# EAGLE design Adafruit MAX98306 (EAGLE 6.4)
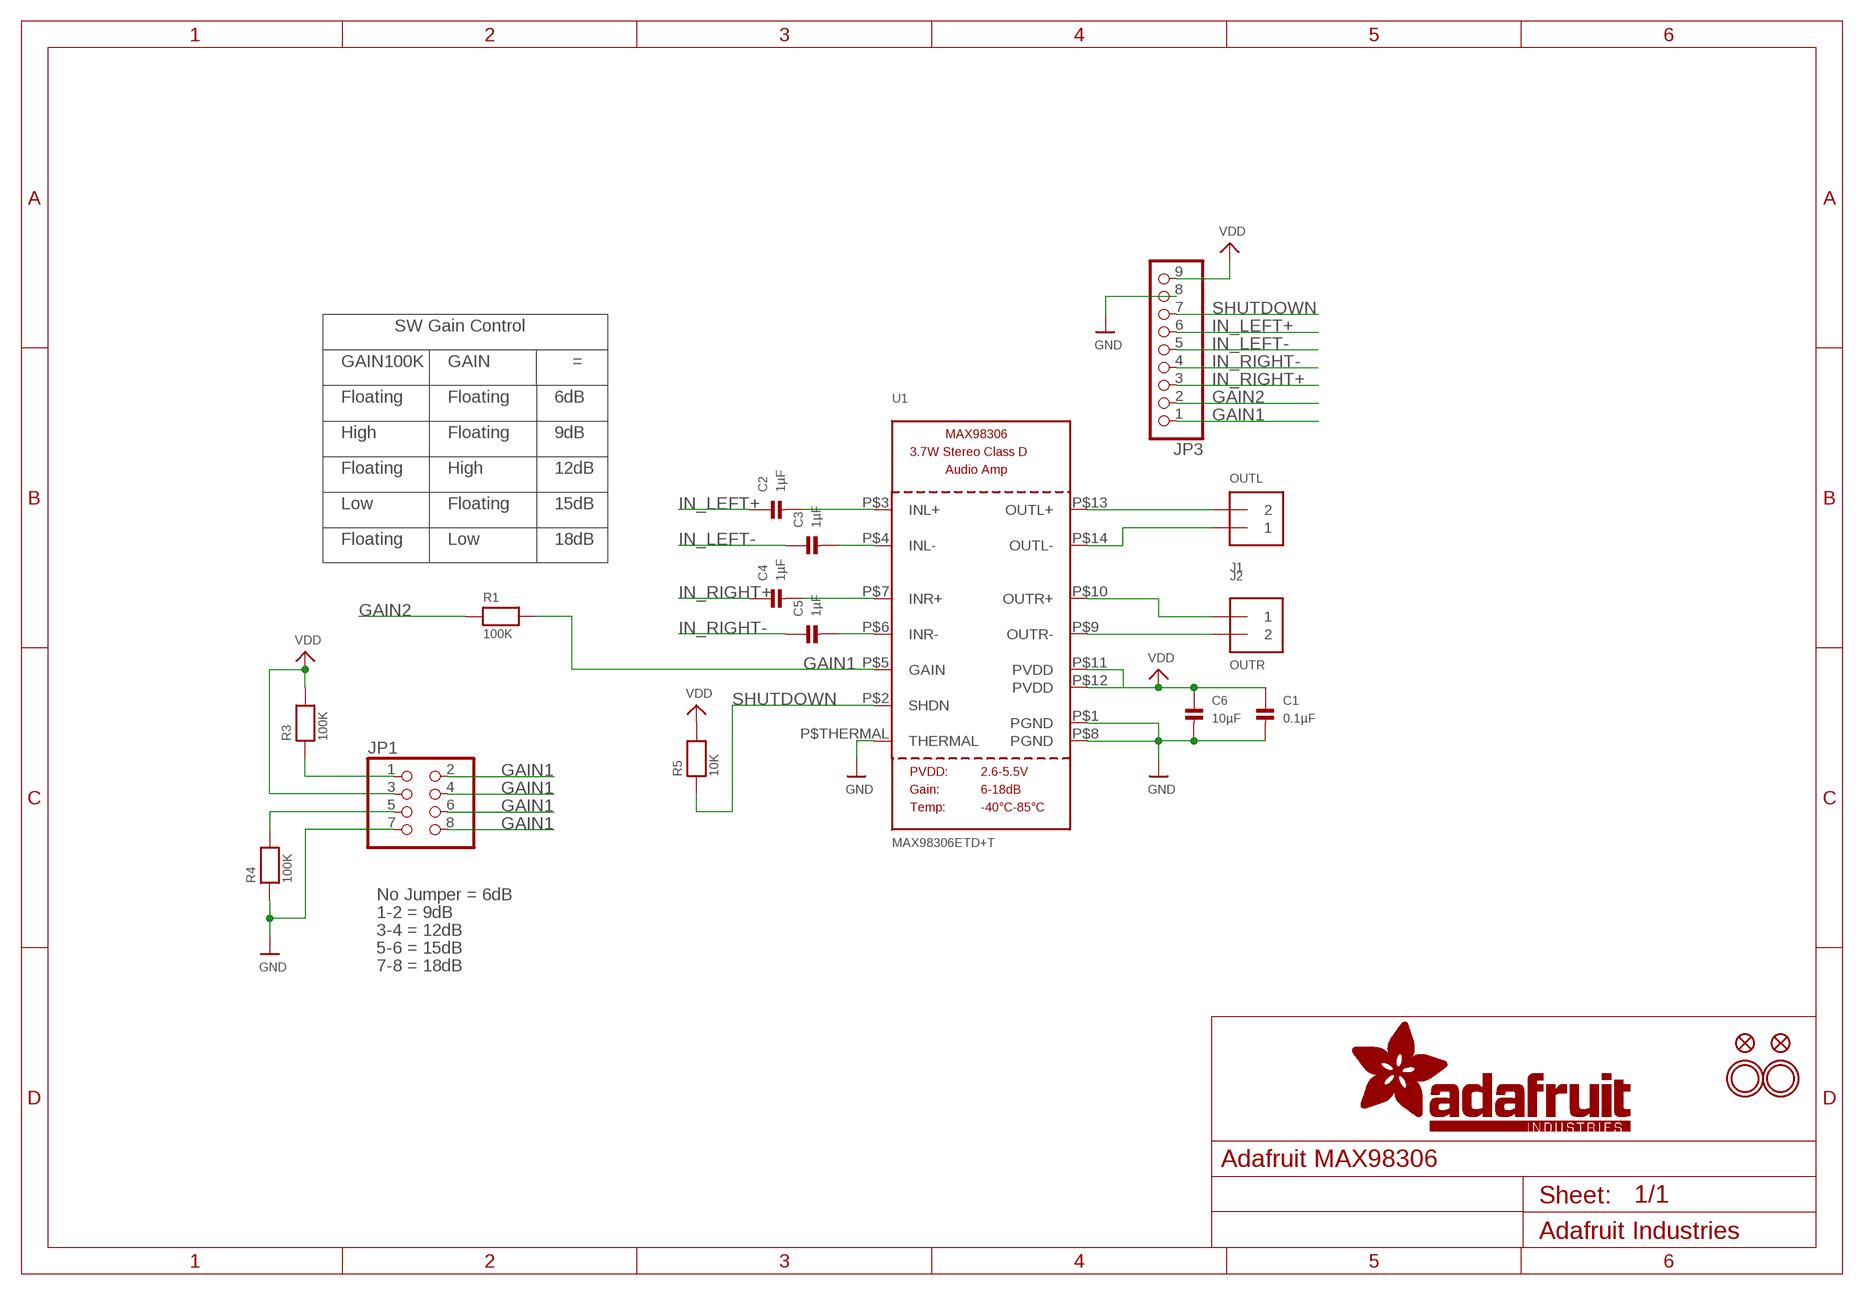
[diagram p0: schematic, sheet 1]

## Parts
C1  0.1µF  CAP_CERAMIC0805  [0805]
C2  1µF  CAP_CERAMIC0805  [0805]
C3  1µF  CAP_CERAMIC0805  [0805]
C4  1µF  CAP_CERAMIC0805  [0805]
C5  1µF  CAP_CERAMIC0805  [0805]
C6  10µF  CAP_CERAMIC0805  [0805]
FID1  FIDUCIAL""  [FIDUCIAL_1MM]
FID2  FIDUCIAL""  [FIDUCIAL_1MM]
J1  OUTL  TERMBLOCK_1X2  [TERMBLOCK_1X2-3.5MM]
J2  OUTR  TERMBLOCK_1X2  [TERMBLOCK_1X2-3.5MM]
JP1  PINHD-2X4  [2X04]
JP3  HEADER-1X970MIL  [1X09_ROUND_70]
R1  100K  RESISTOR0805  [0805]
R3  100K  RESISTOR0805  [0805]
R4  100K  RESISTOR0805  [0805]
R5  10K  RESISTOR0805  [0805]
U1  MAX98306ETD+T  AUDIOAMP_MAX98306  [TDFN14_3X3MM]
U$6  MOUNTINGHOLE2.5  [MOUNTINGHOLE_2.5_PLATED]
U$7  MOUNTINGHOLE2.5  [MOUNTINGHOLE_2.5_PLATED]

## Nets
GAIN1: JP1.2 JP1.4 JP1.6 JP1.8 JP3.1 R1.2 U1.P$5(GAIN)
GAIN2: JP3.2 R1.1
GND: C1.2 C6.2 JP1.7 JP3.8 R4.1 U1.P$1(PGND) U1.P$8(PGND) U1.P$THERMAL(THERMAL)
IN_LEFT+: C2.1 JP3.6
IN_LEFT-: C3.1 JP3.5
IN_RIGHT+: C4.1 JP3.3
IN_RIGHT-: C5.1 JP3.4
LOUT-: J1.1 U1.P$14(OUTL-)
N$1: JP1.1 R3.1
N$2: C2.2 U1.P$3(INL+)
N$3: JP1.5 R4.2
N$4: C3.2 U1.P$4(INL-)
N$5: C4.2 U1.P$7(INR+)
N$6: C5.2 U1.P$6(INR-)
N$12: J1.2 U1.P$13(OUTL+)
N$15: J2.2 U1.P$9(OUTR-)
ROUT+: J2.1 U1.P$10(OUTR+)
SHUTDOWN: JP3.7 R5.1 U1.P$2(SHDN)
VDD: C1.1 C6.1 JP1.3 JP3.9 R3.2 R5.2 U1.P$11(PVDD) U1.P$12(PVDD)

## Notes on the sheet
- SW Gain Control
- GAIN100K | GAIN | =
- Floating | Floating | 6dB
- High | Floating | 9dB
- Floating | High | 12dB
- Low | Floating | 15dB
- Floating | Low | 18dB
- No Jumper = 6dB
- 1-2 = 9dB
- 3-4 = 12dB
- 5-6 = 15dB
- 7-8 = 18dB

## Library data of the parts
C1-C6 = microbuilder:CAP_CERAMIC: Ceramic Capacitors 0402 - 0402 Surface Mount Capacitors 16pF 50V 5% [Digikey: 445-4899-2-ND] 18pF 50V 5% [Digikey: 490-1281-2-ND] 22pF 50V 5% [Digikey: 490-1283-2-ND] 68pF 50V 5% [Digikey: 490-1289-2-ND] 0.1uF 10V 10% [Digikey: 490-1318-2-ND] 1.0uF 6.3V 10% [Digikey: 490-1320-2-ND] 0603 - 0603 Surface Mount Capacitors 16 pF 50V 5% [Digikey: 445-5051-2-ND] 22 pF 50V [Digikey: PCC220ACVTR-ND] 33 pF 50V 5% [Digikey: 490-1415-1-ND] 56pF 50V 5% [Digikey: 490-1421-1-ND] 220pF 50V 5% [Digikey: 445-1285-1-ND] 680 pF 50V 2200 pF 50V 5% C0G [Digikey: 445-1297-1-ND] 5600 pF 100V 5% X7R [Digikey: 478-3711-1-ND] 0.1 µF 25V 10% [Digikey: PCC2277TR-ND] 0.22 µF 16V 10% X7R [Digikey: 445-1318-1-ND] 1.0 µF 25V 10% [Digikey: 445-5146-2-ND] 0603 - RF Specific 3pF 250V +/-0.1pF RF [Digikey: 712-1347-1-ND] 18 pF 250V 5% [Digikey: 478-3505-1-ND or 712-1322-1-ND] 56 pF 250V 5% C0G RF [Digikey: 490-4867-1-ND] 68 pF 250V RF [Digikey: 490-4868-1-ND] 0805 - 0805 Surface Mount Capacitors 220 pF 250V 2% RF Ceramic Capacitor [Digikey: 712-1398-1-ND] 1000 pF 50V 2% NP0 Ceramic Capacitor [Digikey: 478-3760-1-ND] 0.1 µF 25V 10% Ceramic Capacitor [Digikey: PCC1828TR-ND] 1.0 µF 16V 10% Ceramic Capacitor[Digikey: 490-1691-2-ND] 10.0 µF 10V 10% Ceramic Capacitor[Digikey: 709-1228-1-ND] 10.0 uF 16V 10% Ceramic Capacitor [Digikey: 478-5165-2-ND] 47 uF 6.3V 20% Ceramic Capacitor [Digikey: 587-1779-1-ND or 399-5506-1-ND] 1206 - 1206 Surface Mount Capacitors 47uF 10V 20% Ceramic Capacitor [Digikey: 490-5528-1-ND or 399-5508-1-ND or 445-6010-1-ND] 100uF 6.3V -20%, +80% Y5V Ceramic Capacitor (Digikey: 490-4512-1-ND, Mouser: 81-GRM31CF50J107ZE1L)
FID1 FID2 = microbuilder:FIDUCIAL: Fiducial Alignment Points Various fiducial points for machine vision alignment.
J1 J2 = microbuilder:TERMBLOCK_1X2: 3.5mm Terminal block http://www.ladyada.net/library/pcb/eaglelibrary.html
JP1 = adafruit:PINHD-2X4: PIN HEADER
JP3 = microbuilder:HEADER-1X9: PIN HEADER
R1 R3-R5 = microbuilder:RESISTOR: Resistors 0402 - 0402 Surface Mount Package 22 Ohm 1% 1/16W [Digikey: 311-22.0LRTR-ND] 33 Ohm 5% 1/16W 1.0K 5% 1/16W 1.5K 5% 1/16W 2.0K 1% 1/16W 10.0K 1% 1/16W [Digikey: 311-10.0KLRTR-ND] 10.0K 5% 1/16W [Digikey: RMCF0402JT10K0TR-ND] 12.1K 1% 1/16W [Digikey: 311-22.0LRTR-ND] 100.0K 5% 1/16W 0603 - 0603 Surface Mount Package 0 Ohm 1/10 Watt 1% Resistor 15 Ohm 1/10 Watt 1% Resistor 33 Ohm 1/10 Watt 1% Resistor 49.9 Ohm 1/10 Watt 1% Resistor 100 Ohm 1/10 Watt 1% Resistor 150 Ohm 1/10 Watt 1% Resistor 240 Ohm 1/10 Watt 1% Resistor 390 Ohm 1/10 Watt 1% Resistor 560 Ohm 1/10 Watt 1% Resistor 680 Ohm 1/10 Watt 1% Resistor 750 Ohm 1/10 Watt 1% Resistor 1.0K Ohm 1/10 Watt 1% Resistor 1.5K Ohm 1/10 Watt 1% Resistor 2.0K Ohm 1/10 Watt 1% Resistor 2.2K Ohm 1/10 Watt 1% Resistor 3.3K Ohm 1/10 Watt 1% Resistor 4.7K Ohm 1/10 Watt 1% Resistor 10.0K Ohm 1/10 Watt 1% Resistor 12.0K Ohm 1/10 Watt 1% Resistor 12.1K Ohm 1/10 Watt 1% Resistor 20.0K Ohm 1/10 Watt 1% Resistor 33.0K Ohm 1/10 Watt 1% Resistor 100.0K Ohm 1/10 Watt 1% Resistor 0805 - 0805 Surface Mount Package 0 Ohm 1/8 Watt 1% Resistor 33 Ohm 1/8 Watt 1% Resistor 100 Ohm 1/8 Watt 1% Resistor 150 Ohm 1/8 Watt 1% Resistor 200 Ohm 1/8 Watt 1% Resistor 240 Ohm 1/8 Watt 1% Resistor 330 Ohm 1/8 Watt 1% Resistor 390 Ohm 1/8 Watt 1% Resistor 470 Ohm 1/8 Watt 1% Resistor 1.0K Ohm 1/8 Watt 1% Resistor 1.5K Ohm 1/8 Watt 1% Resistor 2.0K Ohm 1/8 Watt 1% Resistor 4.7K Ohm 1/8 Watt 1% Resistor 5.1K Ohm 1/8 Watt 1% Resistor 5.6K Ohm 1/8 Watt 1% Resistor 10.0K Ohm 1/8 Watt 1% Resistor 22.0K Ohm 1/8 Watt 1% Resistor 33.0K Ohm 1/8 Watt 1% Resistor 100K Ohm 1/8 Watt 1% Resistor 1206 - 1206 Surface Mount Package 2012 - 2010 Surface Mount Package 0.11 Ohm 1/2 Watt 1% Resistor - Digikey: RHM.11UCT-ND
U1 = microbuilder:AUDIOAMP_MAX98306: MAX98306 3.7W Stereo Audio Amp - TDFN14 3.7W @ 3 ohm, 2.6-5.5V supply, 6-18dB selectable gain
U$6 U$7 = microbuilder:MOUNTINGHOLE: Mounting Hole For #2 screws (0.086"/2.18mm width, 0.094"/2.4mm hole) use 2.5mm

## Board
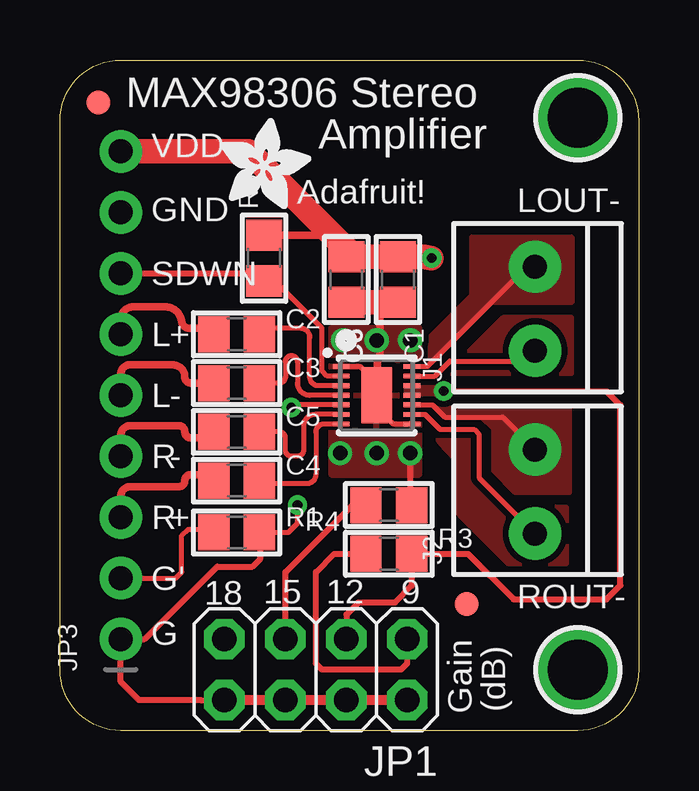
[diagram p1: board, top side]
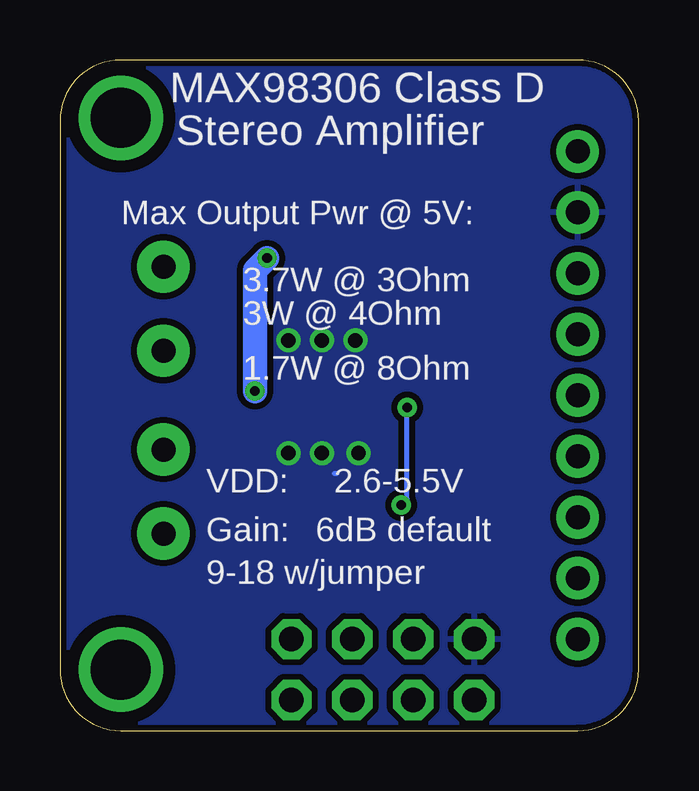
[diagram p2: board, bottom side, seen from below]

Size 24.13 x 27.94 mm. Coordinates in mm from the lower left corner, seen from the top.
Outline: 2.54,0 arc-90 0,2.54 0,25.4 arc-90 2.54,27.94 21.59,27.94 arc-90 24.13,25.4 24.13,2.54 arc-90 21.59,0 2.54,0
Copper layers (1*16): Top 0.035mm / dielectric 1.5mm / Bottom 0.035mm
Design rules "default": minimum track width 6mil, minimum drill 15mil, track to track 6mil, track to pad 6mil, pad to pad 6mil, via to via 6mil, smd to smd 6mil, copper to edge 1mil, drill to drill 8mil, minimum pad ring 10mil, minimum via ring 8mil, stop-mask expansion 4mil, vias tented up to drill 24mil, thermal gap 10mil

### Footprints (pad centres in the part's own frame; a part is rotated, then mirrored left to right if it is on the bottom)
0805 = smd 1.3 x 1.5: 1 -0.95,0; 2 0.95,0
FIDUCIAL_1MM = smd 1 x 1: 1 0,0
TERMBLOCK_1X2-3.5MM = drill 1 pad 2.184: 1 1.8,0; 2 -1.7,0
2X04 = drill 1.016 pad 1.676 octagon: 1 -3.81,-1.27; 2 -3.81,1.27; 3 -1.27,-1.27; 4 -1.27,1.27; 5 1.27,-1.27; 6 1.27,1.27; 7 3.81,-1.27; 8 3.81,1.27
1X09_ROUND_70 = drill 1 pad 1.778: 1 -10.16,0; 2 -7.62,0; 3 -5.08,0; 4 -2.54,0; 5 0,0; 6 2.54,0; 7 5.08,0; 8 7.62,0; 9 10.16,0
TDFN14_3X3MM = smd 0.7 x 0.2: P$1 -1.475,1.2; P$2 -1.475,0.8; P$3 -1.475,0.4; P$4 -1.475,0; P$5 -1.475,-0.4; P$6 -1.475,-0.8; P$7 -1.475,-1.2; P$8 1.475,-1.2; P$9 1.475,-0.8; P$10 1.475,-0.4; P$11 1.475,0; P$12 1.475,0.4; P$13 1.475,0.8; P$14 1.475,1.2 | smd 1.27 x 2.35: P$THERMAL 0,0
MOUNTINGHOLE_2.5_PLATED = drill 2.5 pad 3.2: P$1 0,0

### Placement (x,y rotation side)
C1  14.1,18.8 270 top
C2  7.37,16.51 0 top
C3  7.37,14.48 0 top
C4  7.37,10.41 0 top
C5  7.37,12.45 0 top
C6  11.94,18.8 270 top
FID1  1.6,26.16 0 top
FID2  16.97,5.28 0 top
J1  19.81,17.53 90 top
J2  19.81,9.91 90 top
JP1  10.67,2.54 180 top
JP3  2.54,13.97 90 top
R1  7.37,8.26 0 top
R3  13.72,7.37 0 top
R4  13.72,9.4 180 top
R5  8.51,19.68 90 top
U1  13.21,13.97 0 top
U$6  21.59,2.54 0 top
U$7  21.59,25.53 0 top
U$10  [ADAFRUIT_3.5MM]  6.68,21.72 0 top

### Tracks (layer width: path | path; a pad name or v marks a point on that pad's centre or on a via)
GAIN1  (via drill 0.4)
  Top 0.203: U1.P$5 9.76,13.57 v9.65,13.46 | 8.13,8.44 R1.2 9.53,8.26 9.91,8.64 v9.91,9.4
  Top 0.254: JP1.8 5.87,1.27 3.3,1.27 2.54,2.03 JP3.1 3.53,3.81 5.87,6.15 6.55,6.83 8.03,6.83 8.36,7.16 8.36,8.21 R1.2
  Top 0.406: JP1.2 JP1.4 JP1.6 JP1.8
  Bottom 0.203: v9.65,13.46 9.65,9.65 v9.91,9.4
GAIN2
  Top 0.203: JP3.2 4.83,6.35 5.08,6.6 5.08,8.13 5.33,8.38 6.29,8.38 R1.1 6.29,8.13
GND  (via drill 0.6)
  Top 0.203: U1.P$8 13.9,12.77 13.21,13.46 U1.P$THERMAL 13.21,14.48 12.95,14.73 12.52,15.17 U1.P$1
  Top 0.254: R4.1 14.61,9.46 v14.61,11.56
  Top 0.305: 12.95,14.73 13.23,15.01 13.23,15.39 13.34,15.49 13.34,17.85
  Top 1.016: C6.2 13.34,17.85 C1.2
  Bottom 0.203: 12.7,10.72 12.6,10.72
  other vias: 11.81,16.26 14.61,16.26 11.68,11.56 13.21,11.56 13.21,16.26
  pour Bottom (isolate 0.254): 0,0 0,27.94 24.13,27.94 24.13,0
  pour Top: 11.3,16.76 11.3,10.67 14.99,10.67 14.99,16.76
IN_LEFT+
  Top 0.305: JP3.6 2.54,17.14 arc-90 3.05,17.65 4.32,17.65 arc-90 5.08,17.02 arc90 5.46,16.76 6.16,16.76 arc-90 C2.1
IN_LEFT-
  Top 0.305: JP3.5 2.54,14.86 arc-90 2.92,15.24 4.7,15.24 arc-90 5.21,14.73 arc90 5.46,14.48 C3.1
IN_RIGHT+
  Top 0.305: JP3.3 2.54,9.78 arc-90 2.92,10.16 4.95,10.16 arc90 5.21,10.41 arc-90 5.46,10.67 6.16,10.67 arc-90 C4.1
IN_RIGHT-
  Top 0.305: JP3.4 2.54,12.32 arc-90 2.92,12.7 4.95,12.7 arc-90 5.21,12.45 arc90 5.46,12.19 6.16,12.19 arc90 C5.1
LOUT+
  pour Top (isolate 0.254, no thermals): 15.75,14.88 21.34,14.88 21.34,17.22 18.49,17.22 16.66,15.39 16.26,15.39
LOUT-
  Top 0.203: U1.P$14 15.32,15.17 16.05,15.9 19.2,19.05 19.54,19.05 J1.1
  pour Top (isolate 0.254, no thermals): 15.44,15.29 15.44,16.41 17.17,18.14 17.17,20.57 21.34,20.57 21.34,17.83 17.98,17.83
N$1
  Top 0.203: 12.7,7.3 R3.1
  Top 0.254: JP1.1 14.48,2.79 14.22,2.54 10.92,2.54 10.67,2.79 10.67,6.6 11.43,7.37 R3.1
N$2
  Top 0.203: U1.P$3 10.78,14.37 arc-90 10.41,14.73 10.41,16.38 arc90 10.03,16.76 8.57,16.76 arc90 C2.2
N$3
  Top 0.254: JP1.5 9.4,6.6 12.19,9.4 R4.2
N$4
  Top 0.203: U1.P$4 10.41,13.97 arc-90 9.91,14.48 9.91,15.37 arc90 9.65,15.62 arc90 9.4,15.37 9.4,14.73 arc-90 9.14,14.48 C3.2
N$5
  Top 0.203: U1.P$7 10.99,12.77 arc90 10.67,12.45 10.67,10.67 arc-90 10.29,10.29 8.44,10.29 arc-90 C4.2
N$6
  Top 0.203: U1.P$6 10.63,13.17 arc90 10.16,12.7 10.16,11.68 arc-90 9.91,11.43 9.65,11.43 arc-90 9.4,11.68 9.4,12.19 arc90 9.14,12.45 C5.2
N$12
  Top 0.203: U1.P$13 15.63,14.77 16.26,15.39 19.38,15.39 J1.2
N$15
  Top 0.203: U1.P$9 15.23,13.17 15.85,12.55 17.27,12.55 17.48,12.34 17.48,10.54 J2.2
ROUT+
  Top 0.203: U1.P$10 15.54,13.57 16.05,13.06 18.46,13.06 J2.1
  pour Top (isolate 0.254, no thermals): 15.65,13.46 21.23,13.46 21.23,9.91 19,9.91 18.08,10.82 18.08,12.55 17.58,13.06 16.05,13.06
ROUT-
  pour Top (isolate 0.254, no thermals): 15.44,12.95 15.44,12.45 16.05,11.73 16.56,11.23 16.56,9.09 18.69,6.96 21.13,6.96 21.13,9.3 18.69,9.3 17.48,10.52 17.48,12.34 17.27,12.55 15.75,12.55
SHUTDOWN
  Top 0.203: U1.P$2 11.14,14.77 10.92,14.99 10.92,16.76 8.89,18.8
  Top 0.254: JP3.7 8.19,19.05 R5.1 8.57,18.8 8.89,18.8
VDD  (via drill 0.4)
  Top 0.203: 16.08,14.07 v16,14.15
  Top 0.254: v16,14.15 16.03,14.12 22.81,14.12 23.37,13.56 23.37,6.04 22.78,5.46 18.92,5.46 17.02,7.37 R3.2 14.67,6.03 13.97,5.33 12.45,5.33 11.94,4.83 JP1.3
  Top 0.305: R5.2 11.37,20.64
  Top 1.016: JP3.9 7.87,24.13 11.37,20.64 11.94,20.07 C6.1 C1.1 15.17,19.75 v15.49,19.68
  Bottom 1.016: v16,14.15 16,19.18 v15.49,19.68
  pour Top (isolate 0.254, no thermals): 14.45,14.35 16.26,14.35 16.26,13.97 14.45,13.97

### Text on the board
tPlace: MAX98306 Stereo | VDD | Amplifier | Adafruit! | LOUT- | GND | SDWN | L | + | L | - | R | - | R | + | G' | 18 | 15 | 12 | 9 | ROUT- | G | Gain | (dB)
bPlace: MAX98306 Class D | Stereo Amplifier | Max Output Pwr @ 5V: | 3.7W @ 3Ohm | 3W @ 4Ohm | 1.7W @ 8Ohm | 2.6-5.5V | VDD: | 6dB default | Gain: | 9-18 w/jumper